# EAGLE design PanningMixer (EAGLE 7.5.0)
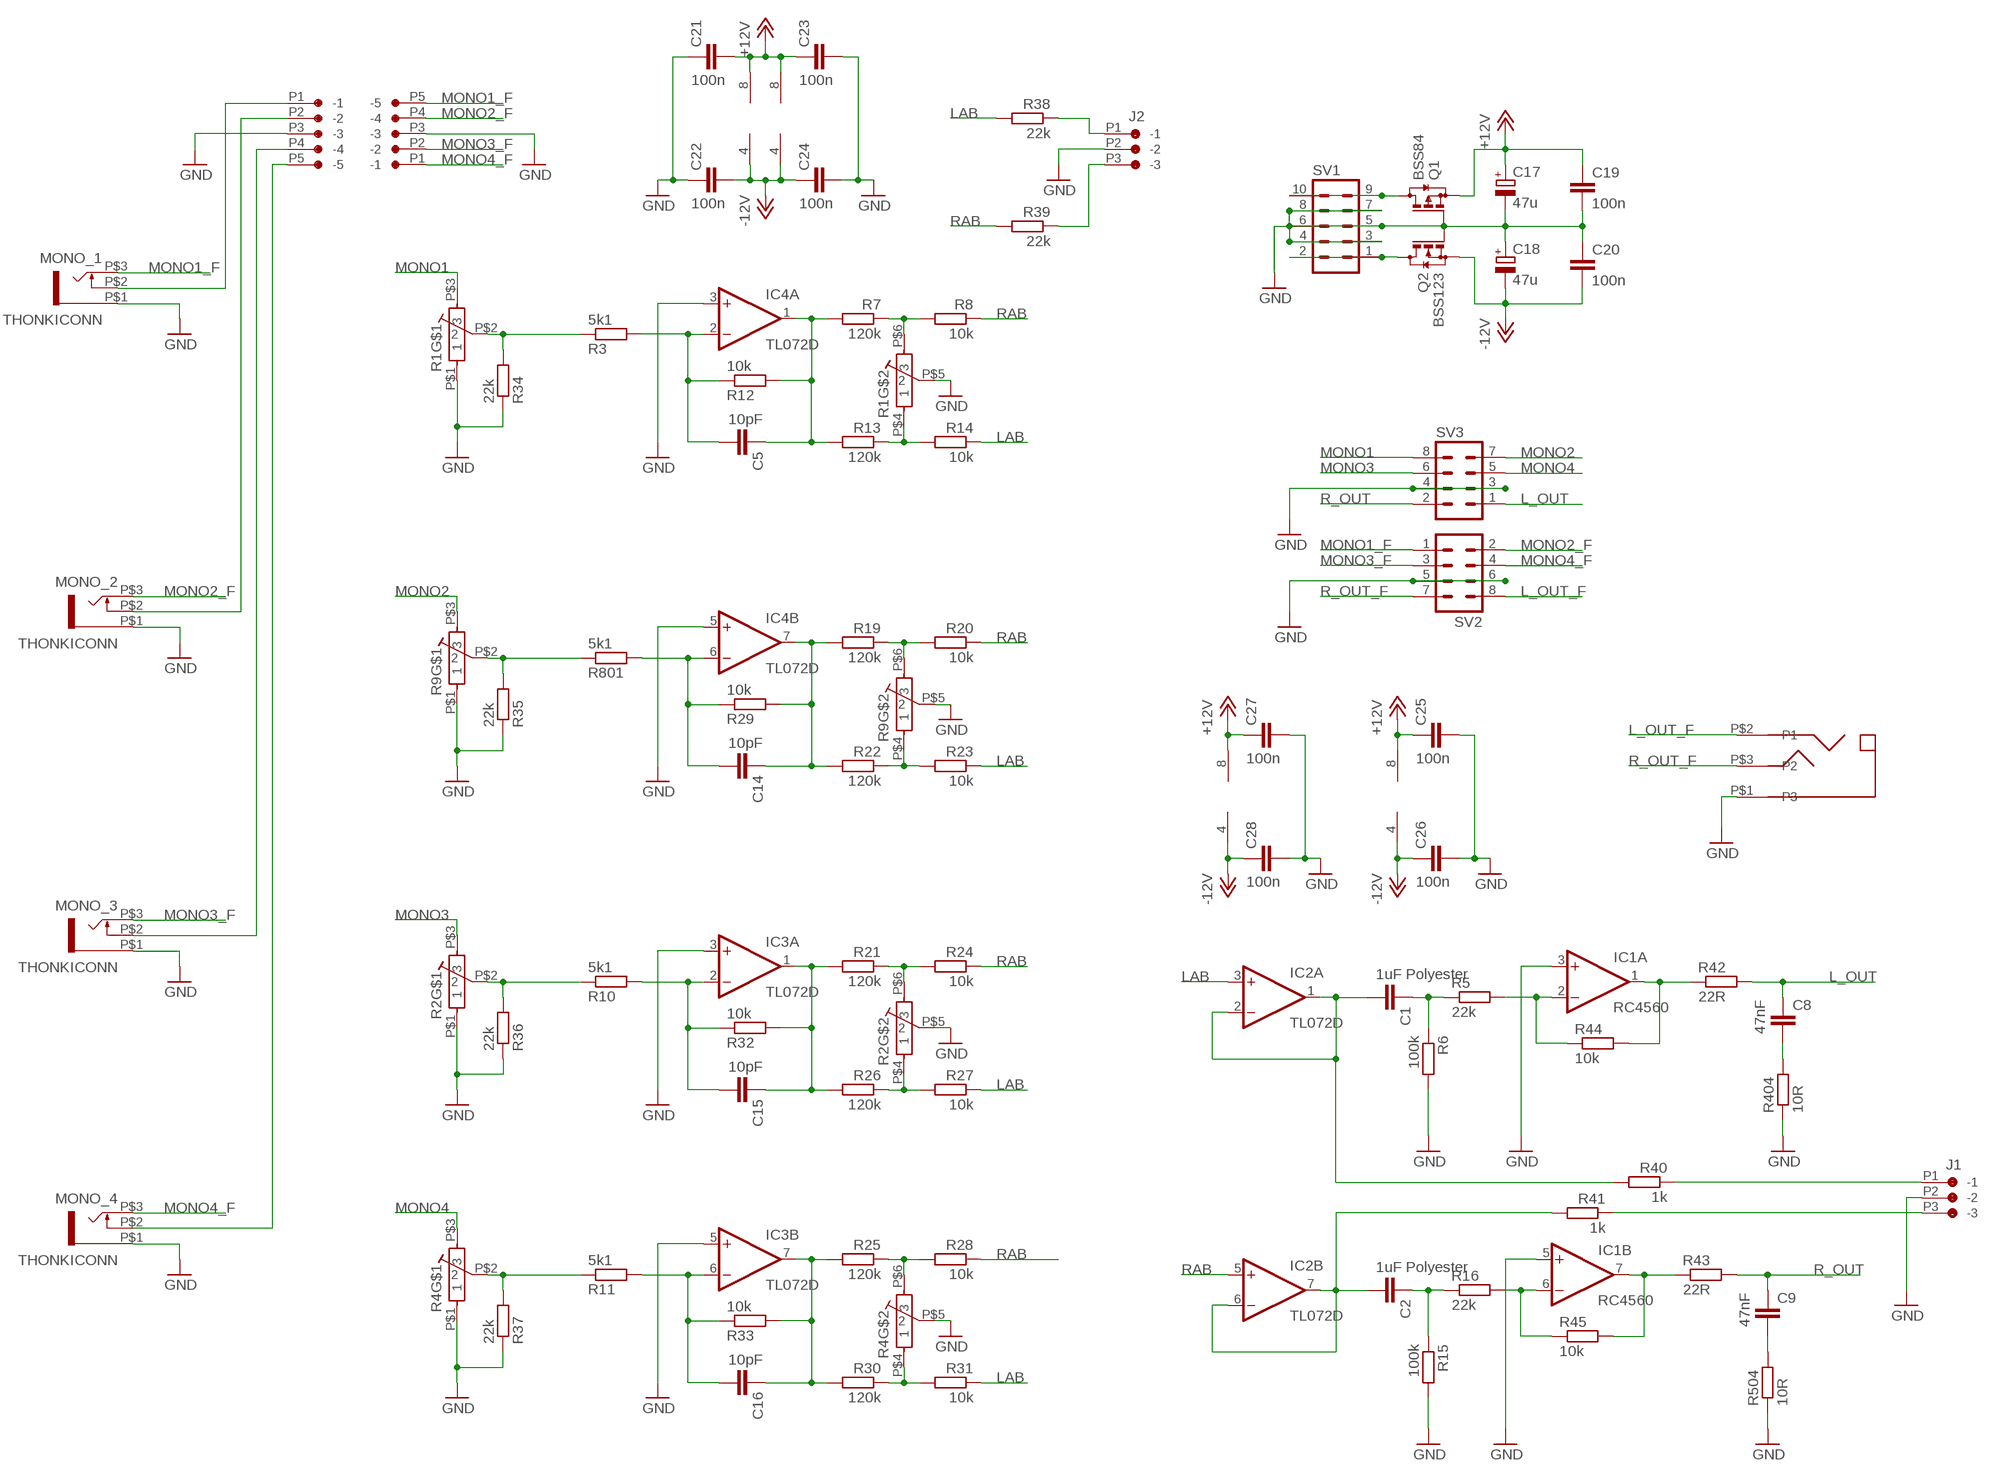
[diagram p0: schematic, sheet 1]

## Parts
C1  1uF Polyester  C-EUC1210  [C1210]
C2  1uF Polyester  C-EUC1210  [C1210]
C5  10pF  C-EUC0603  [C0603]
C8  47nF  C-EUC0603  [C0603]
C9  47nF  C-EUC0603  [C0603]
C14  10pF  C-EUC0603  [C0603]
C15  10pF  C-EUC0603  [C0603]
C16  10pF  C-EUC0603  [C0603]
C17  47u  CPOL-EUB  [PANASONIC_B]
C18  47u  CPOL-EUB  [PANASONIC_B]
C19  100n  C-EUC0603  [C0603]
C20  100n  C-EUC0603  [C0603]
C21  100n  C-EUC0603  [C0603]
C22  100n  C-EUC0603  [C0603]
C23  100n  C-EUC0603  [C0603]
C24  100n  C-EUC0603  [C0603]
C25  100n  C-EUC0603  [C0603]
C26  100n  C-EUC0603  [C0603]
C27  100n  C-EUC0603  [C0603]
C28  100n  C-EUC0603  [C0603]
IC1  RC4560  RC4559D  [SO08]
IC2  TL072D  [SO08]
IC3  TL072D  [SO08]
IC4  TL072D  [SO08]
J1  CON-JST_PH_3W  [CON-JST_PH_3W]
J2  CON-JST_PH_3W  [CON-JST_PH_3W]
MONO_1  THONKICONN  [THONKICONN]
MONO_2  THONKICONN  [THONKICONN]
MONO_3  THONKICONN  [THONKICONN]
MONO_4  THONKICONN  [THONKICONN]
Q1  BSS84  [SOT23]
Q2  BSS123  [SOT23]
R1  POT-ALPHA_DUAL_9MM  [POT-ALPA_DUAL_9MM]
R2  POT-ALPHA_DUAL_9MM  [POT-ALPA_DUAL_9MM]
R3  5k1  R-EU_0603  [0603]
R4  POT-ALPHA_DUAL_9MM  [POT-ALPA_DUAL_9MM]
R5  22k  R-EU_0603  [0603]
R6  100k  R-EU_0603  [0603]
R7  120k  R-EU_0603  [0603]
R8  10k  R-EU_0603  [0603]
R9  POT-ALPHA_DUAL_9MM  [POT-ALPA_DUAL_9MM]
R10  5k1  R-EU_0603  [0603]
R11  5k1  R-EU_0603  [0603]
R12  10k  R-EU_0603  [0603]
R13  120k  R-EU_0603  [0603]
R14  10k  R-EU_0603  [0603]
R15  100k  R-EU_0603  [0603]
R16  22k  R-EU_0603  [0603]
R19  120k  R-EU_0603  [0603]
R20  10k  R-EU_0603  [0603]
R21  120k  R-EU_0603  [0603]
R22  120k  R-EU_0603  [0603]
R23  10k  R-EU_0603  [0603]
R24  10k  R-EU_0603  [0603]
R25  120k  R-EU_0603  [0603]
R26  120k  R-EU_0603  [0603]
R27  10k  R-EU_0603  [0603]
R28  10k  R-EU_0603  [0603]
R29  10k  R-EU_0603  [0603]
R30  120k  R-EU_0603  [0603]
R31  10k  R-EU_0603  [0603]
R32  10k  R-EU_0603  [0603]
R33  10k  R-EU_0603  [0603]
R34  22k  R-EU_0603  [0603]
R35  22k  R-EU_0603  [0603]
R36  22k  R-EU_0603  [0603]
R37  22k  R-EU_0603  [0603]
R38  22k  R-EU_0603  [0603]
R39  22k  R-EU_0603  [0603]
R40  1k  R-EU_0603  [0603]
R41  1k  R-EU_0603  [0603]
R42  22R  R-EU_0603  [0603]
R43  22R  R-EU_0603  [0603]
R44  10k  R-EU_0603  [0603]
R45  10k  R-EU_0603  [0603]
R404  10R  R-EU_0603  [0603]
R504  10R  R-EU_0603  [0603]
R801  5k1  R-EU_0603  [0603]
SV1  MA05-2  [MA05-2]
SV2  MA04-2  [MA04-2]
SV3  MA04-2  [MA04-2]
U1  CON-PROSIGNAL_MJ-355W  [CON-PROSIGNAL_MJ-355W]
U2  CON-JST_PH_5W  [CON-JST_PH_5W]
U4  CON-JST_PH_5W  [CON-JST_PH_5W]

## Nets
+12V: C17.+ C19.1 C21.2 C23.1 C25.1 C27.1 IC1.8(P:V+) IC2.8(P:V+) IC3.8(P:V+) IC4.8(P:V+) Q1.2(S)
-12V: C18.- C20.2 C22.2 C24.1 C26.1 C28.1 IC1.4(P:V-) IC2.4(P:V-) IC3.4(P:V-) IC4.4(P:V-) Q2.2(S)
GND: C17.- C18.+ C19.2 C20.1 C21.1 C22.1 C23.2 C24.2 C25.2 C26.2 C27.2 C28.2 IC1.3(A:+IN) IC1.5(B:+IN) IC3.3(A:+IN) IC3.5(B:+IN) IC4.3(A:+IN) IC4.5(B:+IN) J1.P2(-2) J2.P2(-2) Q1.1(G) Q2.1(G) R1.P$1 R1.P$5 R2.P$1 R2.P$5 R4.P$1 R4.P$5 R6.2 R9.P$1 R9.P$5 R15.2 R34.1 R35.1 R36.1 R37.1 R404.1 R504.1 SV1.3 SV1.4 SV1.5 SV1.6 SV1.7 SV1.8 SV3.3 SV3.4
GND_A: MONO_1.P$1 MONO_2.P$1 MONO_3.P$1 MONO_4.P$1 SV2.5 SV2.6 U1.P$1(P3) U2.P3(-3) U4.P3(-3) ; supply symbol labelled GND
L_OUT: C8.1 R42.2 SV3.1
L_OUT_F: SV2.8 U1.P$2(P1)
LAB: IC2.3(A:+IN) R14.1 R23.1 R27.1 R31.1 R38.2
MONO1: R1.P$3 SV3.8
MONO1_F: MONO_1.P$3 SV2.1 U4.P5(-5)
MONO2: R9.P$3 SV3.7
MONO2_F: MONO_2.P$3 SV2.2 U4.P4(-4)
MONO3: R2.P$3 SV3.6
MONO3_F: MONO_3.P$3 SV2.3 U4.P2(-2)
MONO4: R4.P$3 SV3.5
MONO4_F: MONO_4.P$3 SV2.4 U4.P1(-1)
N$1: R4.P$2 R11.1 R37.2
N$2: MONO_2.P$2 U2.P2(-2)
N$4: MONO_1.P$2 U2.P1(-1)
N$5: C1.1 R5.1 R6.1
N$6: MONO_3.P$2 U2.P4(-4)
N$7: IC1.2(A:-IN) R5.2 R44.1
N$8: R1.P$2 R3.1 R34.2
N$9: C5.2 IC4.2(A:-IN) R3.2 R12.1
N$10: R2.P$2 R10.1 R36.2
N$11: R9.P$2 R35.2 R801.1
N$12: C9.2 R504.2
N$14: J2.P1(-1) R38.1
N$15: MONO_4.P$2 U2.P5(-5)
N$16: J1.P1(-1) R40.1
N$17: R1.P$4 R13.1 R14.2
N$19: R1.P$6 R7.1 R8.2
N$20: J1.P3(-3) R41.1
N$21: C8.2 R404.2
N$22: C2.1 R15.1 R16.1
N$23: C5.1 IC4.1(A:OUT) R7.2 R12.2 R13.2
N$24: J2.P3(-3) R39.1
N$25: C16.1 IC3.7(B:OUT) R25.2 R30.2 R33.2
N$26: C14.1 IC4.7(B:OUT) R19.2 R22.2 R29.2
N$27: IC1.1(A:OUT) R42.1 R44.2
N$28: IC1.6(B:-IN) R16.2 R45.1
N$30: C1.2 IC2.1(A:OUT) IC2.2(A:-IN) R40.2
N$31: IC1.7(B:OUT) R43.1 R45.2
N$32: C2.2 IC2.6(B:-IN) IC2.7(B:OUT) R41.2
N$33: R9.P$6 R19.1 R20.2
N$35: R9.P$4 R22.1 R23.2
N$36: R2.P$6 R21.1 R24.2
N$37: C15.1 IC3.1(A:OUT) R21.2 R26.2 R32.2
N$38: R2.P$4 R26.1 R27.2
N$39: R4.P$6 R25.1 R28.2
N$41: R4.P$4 R30.1 R31.2
N$43: C14.2 IC4.6(B:-IN) R29.1 R801.2
N$44: Q2.3(D) SV1.1 SV1.2
N$45: C15.2 IC3.2(A:-IN) R10.2 R32.1
N$46: Q1.3(D) SV1.9 SV1.10
N$47: C16.2 IC3.6(B:-IN) R11.2 R33.1
R_OUT: C9.1 R43.2 SV3.2
R_OUT_F: SV2.7 U1.P$3(P2)
RAB: IC2.5(B:+IN) R8.1 R20.1 R24.1 R28.1 R39.2

## Library data of the parts
C1 C2 C5 C8 C9 C14-C16 C19-C28 = Rebel:C-EU: CAPACITOR, European symbol
C17 C18 = Rebel:CPOL-EU: POLARIZED CAPACITOR, European symbol
IC1 = linear:RC4559: OP AMP
IC2-IC4 = linear:TL072: OP AMP
J1 J2 = Rebel:CON-JST_PH_3W
MONO_1-MONO_4 = Rebel:THONKICONN
Q1 = transistor-small-signal:BSS84: P-CHANNEL MOS FET
Q2 = transistor-small-signal:BSS123: N-CHANNEL MOS FET
R1 R2 R4 R9 = Rebel:POT-ALPHA_DUAL_9MM
R3 R5-R8 R10-R16 R19-R45 R404 R504 R801 = Rebel:R-EU_: RESISTOR, European symbol
SV1 = con-lstb:MA05-2: PIN HEADER; OC_FARNELL: unknown; OC_NEWARK: unknown
SV2 SV3 = con-lstb:MA04-2: PIN HEADER; OC_FARNELL: unknown; OC_NEWARK: unknown
U1 = Rebel:CON-PROSIGNAL_MJ-355W
U2 U4 = Rebel:CON-JST_PH_5W

## Board
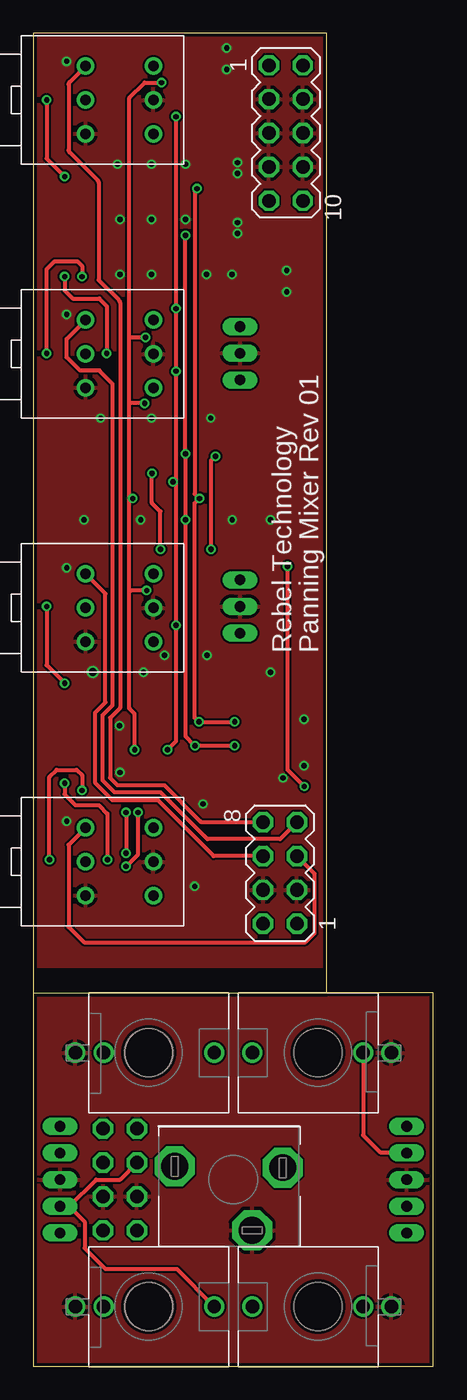
[diagram p1: board, top side]
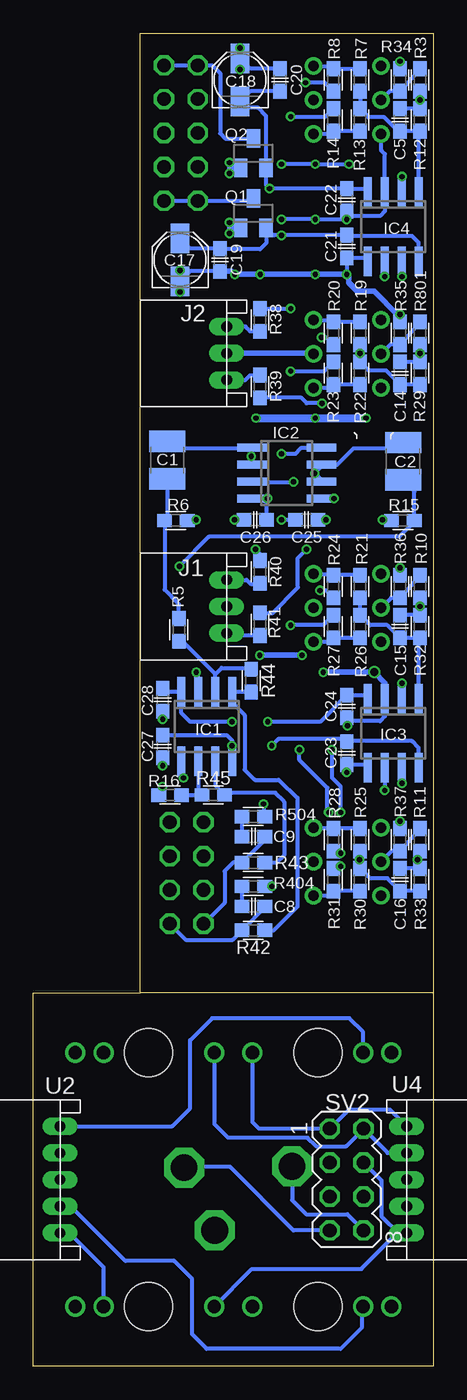
[diagram p2: board, bottom side, seen from below]

Size 30 x 100 mm. Coordinates in mm from the lower left corner, seen from the top.
Outline: 22,28 30,28 30,0 0,0 0,28
Outline: 0,28 22,28
Outline: 0,28 0,100 22,100 22,28
Copper layers (1*16): Top 0.035mm / dielectric 1.5mm / Bottom 0.035mm
Design rules "SeeedStudio_2layer_DRU_no_angle_20140221": minimum track width 6mil, minimum drill 12mil, track to track 6mil, track to pad 6mil, pad to pad 6mil, via to via 6mil, smd to smd 0mil, copper to edge 10mil, drill to drill 10mil, minimum pad ring 10mil, minimum via ring 6mil, stop-mask expansion 2mil, vias tented up to drill 100mil, thermal gap 10mil

### Footprints (pad centres in the part's own frame; a part is rotated, then mirrored left to right if it is on the bottom)
C1210 = smd 1.6 x 2.7: 1 -1.4,0; 2 1.4,0
C0603 = smd 1.1 x 1: 1 -0.85,0; 2 0.85,0
PANASONIC_B = smd 2.2 x 1.4: + 1.6,0; - -1.6,0
SO08 = smd 0.6 x 2.2: 1 -1.905,-2.6; 2 -0.635,-2.6; 3 0.635,-2.6; 4 1.905,-2.6; 5 1.905,2.6; 6 0.635,2.6; 7 -0.635,2.6; 8 -1.905,2.6
CON-JST_PH_3W = drill 0.8 long: P1 0,0; P2 -2,0; P3 -4,0
THONKICONN = drill 1: P$1 0,-5.5; P$2 0,-3.38; P$3 0,4.92 | hole 3.6: 0,0
SOT23 = smd 1 x 1.4: 1 -0.95,-1.1; 2 0.95,-1.1; 3 0,1.1
POT-ALPA_DUAL_9MM = drill 0.8: P$1 -2.54,5.08; P$2 0,5.08; P$3 2.54,5.08; P$4 -2.54,0; P$5 0,0; P$6 2.54,0
0603 = smd 1.1 x 1: 1 -0.85,0; 2 0.85,0
MA05-2 = drill 1.016 octagon: 1 -5.08,-1.27; 2 -5.08,1.27; 3 -2.54,-1.27; 4 -2.54,1.27; 5 0,-1.27; 6 0,1.27; 7 2.54,-1.27; 8 2.54,1.27; 9 5.08,-1.27; 10 5.08,1.27
MA04-2 = drill 1.016 octagon: 1 -3.81,-1.27; 2 -3.81,1.27; 3 -1.27,-1.27; 4 -1.27,1.27; 5 1.27,-1.27; 6 1.27,1.27; 7 3.81,-1.27; 8 3.81,1.27
CON-PROSIGNAL_MJ-355W = drill 2 octagon: P$1 -3.8,-1.4; P$2 1,4.4; P$3 0.9,-3.7
CON-JST_PH_5W = drill 0.8 long: P1 0,0; P2 -2,0; P3 -4,0; P4 -6,0; P5 -8,0

### Placement (x,y rotation side)
C1  19.95,67.98 90 bottom
C2  2.27,67.89 90 bottom
C5  2.5,93.5 90 bottom
C8  13.5,34.5 180 bottom
C9  13.5,39.73 180 bottom
C14  2.5,74.5 90 bottom
C15  2.5,55.5 90 bottom
C16  2.5,36.5 90 bottom
C17  19,83 90 bottom
C18  14.5,96.5 90 bottom
C19  16,83 270 bottom
C20  11.5,96.5 270 bottom
C21  6.5,84 90 bottom
C22  6.5,87.5 90 bottom
C23  6.5,46 270 bottom
C24  6.5,49.5 270 bottom
C25  9.5,63.5 0 bottom
C26  13.35,63.5 180 bottom
C27  20.3,46.5 270 bottom
C28  20.3,50 270 bottom
IC1  17,48 180 bottom
IC2  11,67 270 bottom
IC3  3,47.5 180 bottom
IC4  3,85.5 180 bottom
J1  15.5,59 90 bottom
J2  15.5,78 90 bottom
MONO_1  8.65,23.52 270 top
MONO_2  21.35,23.52 90 top
MONO_3  8.65,4.47 270 top
MONO_4  21.35,4.47 90 top
Q1  13.5,86.5 0 bottom
Q2  13.5,91 0 bottom
R1  9,95 90 top
R2  9,56.9 90 top
R3  1,96.5 270 bottom
R4  9,37.85 90 top
R5  19.08,55.24 270 bottom
R6  19.31,63.45 0 bottom
R7  5.5,96.5 270 bottom
R8  7.5,96.5 90 bottom
R9  9,75.95 90 top
R10  1,58.5 270 bottom
R11  1,39.5 270 bottom
R12  22k  [0603]  1,93.5 270 bottom
R13  5.5,93.5 90 bottom
R14  7.5,93.5 270 bottom
R15  2.28,63.45 180 bottom
R16  19.74,42.85 0 bottom
R19  5.5,77.5 270 bottom
R20  7.5,77.5 90 bottom
R21  5.5,58.5 270 bottom
R22  5.5,74.5 90 bottom
R23  7.5,74.5 270 bottom
R24  7.5,58.5 90 bottom
R25  5.5,39.5 270 bottom
R26  5.5,55.5 90 bottom
R27  7.5,55.5 270 bottom
R28  7.5,39.5 90 bottom
R29  22k  [0603]  1,74.5 270 bottom
R30  5.5,36.5 90 bottom
R31  7.5,36.5 270 bottom
R32  22k  [0603]  1,55.5 270 bottom
R33  22k  [0603]  1,36.5 270 bottom
R34  2.5,96.5 270 bottom
R35  2.5,77.5 270 bottom
R36  2.5,58.5 270 bottom
R37  2.5,39.5 270 bottom
R38  13,78.5 90 bottom
R39  13,73.5 270 bottom
R40  13,59.6 90 bottom
R41  13,55.67 90 bottom
R42  13.5,32.7 180 bottom
R43  13.5,37.78 180 bottom
R44  13.65,51.44 270 bottom
R45  16.51,42.86 0 bottom
R404  13.5,36 180 bottom
R504  13.5,41.23 180 bottom
R801  1,77.5 270 bottom
SV1  18.94,92.52 270 top
SV2  6.5,14 270 bottom
SV3  18.5,37 90 top
U1  15,14 90 top
U2  28,18 90 bottom
U4  2,10 270 bottom

### Tracks (layer width: path | path; a pad name or v marks a point on that pad's centre or on a via)
+12V  (via drill 0.4)
  Top 0.305: v11.4,84.85 v11.4,68.45 v11.4,63.5 11.4,47.27 v12.12,46.55 v15.1,46.55
  Bottom 0.305: IC4.8 1.09,84.3 1.6,84.8 6.45,84.8 C21.2 v11.4,84.85 12,84.85 Q1.2 12.55,84.25 13,83.8 15.95,83.8 C19.1 18.25,83.85 C17.+ | IC3.8 1.09,46.4 1.6,46.9 6.45,46.9 C23.1 6.7,47.05 11.62,47.05 v12.12,46.55 | IC2.8 9.9,68.9 10.35,68.45 v11.4,68.45 | C27.1 15.5,47.35 15.1,46.95 v15.1,46.55 IC1.8 | C25.1 v11.4,63.5
-12V  (via drill 0.4)
  Top 0.305: v15.1,48.35 v12.42,48.35 12.1,48.67 12.1,64.75 v12.45,65.1 12.1,65.45 12.1,88.17 v12.29,88.35
  Bottom 0.305: IC4.4 5.16,88.35 C22.2 v12.29,88.35 | IC3.4 5.16,50.35 C24.1 8.5,48.35 v12.42,48.35 | C18.- 13.75,95.65 C20.2 | 14,94.4 13.15,94.4 12.55,93.8 Q2.2 12.55,88.61 v12.29,88.35 | v15.1,48.35 18.25,48.35 18.9,49 IC1.4 20.05,50.6 C28.1 | IC2.4 v12.46,65.09 v12.45,65.1 12.5,65.05 C26.1 | v12.29,88.35 12.1,88.35
  Bottom 0.406: 14,94.4 C18.-
GND  (via drill 0.4, 0.6)
  Bottom 0.305: R1.P$1 3.9,92.44 3.9,91.2 3.63,90.94 IC4.3 3.63,86.67 4,86.3 6.15,86.3 C22.1 6.35,86.5 6.35,86.36 6.66,86.05 v8.86,86.05 v11.4,86.05 | IC4.5 5.16,83.15 C21.1 v6.5,81.92 | IC3.3 3.63,48.77 4,48.4 6.25,48.4 C24.2 | IC3.5 5.16,45.15 C23.2 v6.5,44.55 | C20.1 13.75,97.35 | 13.75,97.35 C18.+ v14.5,98.9 | C19.2 18.25,82.15 | 18.25,82.15 C17.- | 14.53,89.98 Q2.1 14.85,89.5 v15.3,89.5 v15.3,90.3 15.05,90.3 15.05,89.55 | 13.75,97.35 14.45,97.35 14.5,97.4 | 18.25,82.15 18.95,82.15 v19,82.2 | Q1.1 14.85,85.8 v15.3,85.8 v15.3,85 15.05,85 | 15.05,85 14.5,85 | v2.5,40.9 R37.1 | v2.5,59.9 R36.1 | v2.5,97.9 R34.1 | 15.05,85 15.05,85.75 | R504.1 v12.73,42.18 | R404.1 v12.1,36 | C25.2 v8.05,63.5 | 20.3,48.95 C28.2 | 6.35,90.17 8.89,90.17 8.9,90.18 v11.4,90.18 | R35.1 v2.5,78.9 | R15.2 3.76,63.45 v3.81,63.5 | R6.2 17.83,63.45 v17.78,63.5 | C26.2 v14.92,63.5 | IC1.3 17.64,51.92 v17.78,52.07 | IC1.5 18.91,44.3 v18.73,44.13
  Bottom 0.406: C27.2 v20.3,45.05 | C28.2 v20.3,48.55 | v2.5,78.9 2.7,78.9 4.45,80.64 5.71,80.64 6.35,81.28 6.35,81.77 v6.5,81.92 14.92,81.92 15.16,82.15 C19.2 | J2.P2 9.05,76 R9.P$5 | v8.26,52.07 v4.45,52.07 3.63,51.26 IC3.3 | v9.84,53.34 v13.02,53.34
  Bottom 0.61: 13.34,71.12 v8.87,71.12 v8.86,71.13 v5.05,71.13 | R35.1 2.5,78.7 2.54,78.74
  other vias: 14.5,97.3 19,80.6 6.45,48.05 6.5,86.05 8.86,90.18 6.32,90.18 8.86,81.92 12.99,81.92 13.3,71.13 14.89,81.92
  pour Top: 22,30 0,30 0,100 22,100
GND_A
  pour Top: 0,28 30,28 30,0 0,0
L_OUT
  Bottom 0.305: SV3.1 18.58,32 15.05,32 R42.2 12.65,34.4 C8.1
L_OUT_F
  Bottom 0.305: U1.P$2 10.6,12.45 9.55,11.4 6.44,11.4 SV2.8
LAB  (via drill 0.4)
  Top 0.305: v6.95,37.5 7.85,38.4 v7.85,41.55 | 10.7,66.25 v10.7,55.6 10.7,46.9 v10.05,46.25 | 10.7,66.25 v10.7,74.65 v10.7,79.35 v10.7,93.75 | v10.48,66.35 10.7,66.25
  Bottom 0.305: R31.1 7.1,37.35 v6.95,37.5 | v10.7,93.75 8.1,93.75 R14.1 | v10.7,74.65 8.2,74.65 R23.1 | v7.85,41.55 7.9,41.55 7.95,41.6 7.95,43.4 10.05,45.5 v10.05,46.25 | R27.1 8.25,55.6 v10.7,55.6 | IC2.3 12.46,66.36 12.45,66.35 v10.48,66.35 | R38.2 v10.7,79.35
MONO1
  Top 0.305: SV3.8 17.17,40.81 arc45 17.15,40.8 12.71,40.8 arc-45 12.53,40.87 9.8,43.6 6.3,43.6 5.75,44.15 5.75,48.65 6.5,49.4 6.5,79.8 arc45 6.43,79.97 4.9,81.5 4.9,88.8 arc45 4.83,88.97 2.72,91.08 arc-45 2.65,91.25 2.65,96.17 arc-45 2.72,96.34 R1.P$3
MONO1_F
  Bottom 0.305: U4.P5 3.25,19.25 6.33,19.25 SV2.1 13.06,17.81 13.55,18.3 13.55,23.5 MONO_1.P$3
MONO2
  Top 0.305: R9.P$3 2.5,77.07 2.5,75.7 3.5,74.7 4.95,74.7 5.95,73.7 5.95,49.6 5.2,48.85 5.2,43.95 6.1,43.05 9.55,43.05 13.05,39.55 18.51,39.55 SV3.7
MONO2_F
  Bottom 0.305: MONO_2.P$3 16.4,23.5 16.4,18.15 15.4,17.15 9.45,17.15 8.8,16.5 6.54,16.5 SV2.2 3.42,16 U4.P4
MONO3
  Top 0.305: SV3.6 13.53,38.27 9.35,42.45 5.95,42.45 4.65,43.75 4.65,49.05 5.4,49.8 5.4,57.96 R2.P$3
MONO3_F
  Top 0.305: SV2.3 6.5,14 4.7,14 2.7,12 | U4.P2 2.7,12 | 2.7,12 3.85,10.85 3.85,8.85 5.4,7.3 10.74,7.3 MONO_3.P$3
MONO4
  Top 0.305: R4.P$3 2.65,39.12 2.65,32.95 3.8,31.8 20.4,31.8 21.1,32.5 21.1,36.94 SV3.5
MONO4_F
  Bottom 0.305: SV2.4 3.9,13.94 3.9,11.25 2.65,10 | 2.65,10 U4.P1 | MONO_4.P$3 13.61,7.3 5.4,7.3 2.7,10 2.65,10
N$1
  Bottom 0.305: R4.P$2 3.12,38.65 R37.2 R11.1
N$2
  Top 0.305: MONO_2.P$2 24.73,17.32 26,16.05 27.95,16.05 U2.P2
N$4
  Bottom 0.305: U2.P1 19.6,18 18.25,19.35 18.25,24.45 16.6,26.1 6.3,26.1 5.27,25.07 MONO_1.P$2
N$5
  Bottom 0.305: C1.1 19.95,63.66 R6.1 20.16,58.26 19.08,57.18 R5.1
N$6
  Bottom 0.305: U2.P4 27.2,12 23.1,7.9 19.45,7.9 18.1,6.55 18.1,2.4 17,1.3 6.95,1.3 5.37,2.88 5.37,4.33 MONO_3.P$2
N$7
  Bottom 0.305: IC1.2 16.36,51.9 | 16.36,51.9 15.88,52.39 13.76,52.39 R44.1 | 16.36,51.9 16.36,51.92 18.84,54.4 R5.2
N$8
  Bottom 0.305: R1.P$2 3.27,95.65 R34.2 R3.1
N$9  (via drill 0.4)
  Top 0.305: v1,95 1,90.6 v2.35,89.25
  Bottom 0.305: R3.2 v1,95 R12.1 C5.2 | IC4.2 2.37,89.23 v2.35,89.25
N$10
  Bottom 0.305: R2.P$2 3.17,57.65 R36.2 R10.1
N$11
  Bottom 0.305: R9.P$2 3.22,76.65 R35.2 R801.1
N$12
  Bottom 0.305: C9.2 R504.2
N$14
  Bottom 0.305: J2.P1 14.1,78 13.75,77.65 R38.1
N$15
  Bottom 0.305: MONO_4.P$2 24.73,7.43 27.25,9.95 27.95,9.95 U2.P5
N$16
  Bottom 0.305: J1.P1 14,59 13.7,58.7 13.05,58.7 R40.1
N$17
  Bottom 0.305: R13.1 R14.2 7.69,92.46 R1.P$4
N$19
  Bottom 0.305: R1.P$6 7.5,97.54 R8.2 R7.1
N$20
  Bottom 0.305: R41.1 15.32,54.82 J1.P3
N$21
  Bottom 0.305: C8.2 R404.2
N$22  (via drill 0.4)
  Top 0.305: v19.05,60.01 19.05,44.77 v20.32,43.5
  Bottom 0.305: v19.05,60.01 16.83,62.23 2.54,62.23 1.43,63.34 R15.1 1.43,65.65 C2.1 | R16.1 20.59,43.23 v20.32,43.5
N$23
  Bottom 0.305: R7.2 R13.2 4.85,93.7 3.7,93.7 2.65,92.65 C5.1 R12.2 1.09,92.56 IC4.1
N$24
  Bottom 0.305: J2.P3 14.1,74 13.75,74.35 R39.1
N$25  (via drill 0.4)
  Top 0.305: v5.55,38 5.55,41.45 4.9,42.1 3.15,42.1 2.35,42.9 v2.35,43.75 2.35,43.8
  Bottom 0.305: R33.2 C16.1 3.45,36.6 4.75,36.6 R30.2 v5.55,38 R25.2 | IC3.7 2.37,43.77 v2.35,43.75
N$26  (via drill 0.4)
  Top 0.305: v2.35,81.75 2.35,80.7 2.95,80.1 4.95,80.1 5.5,79.55 v5.5,76
  Bottom 0.305: R29.2 C14.1 3.55,74.7 4.85,74.7 R22.2 v5.5,76 R19.2 | IC4.7 2.37,81.77 v2.35,81.75
N$27
  Bottom 0.305: R42.1 11.96,32.7 10.2,34.47 10.2,42.63 11.6,43.98 13.38,43.98 14.15,44.75 14.15,48.85 15.1,49.8 IC1.1 15.08,50.59 R44.2
N$28
  Bottom 0.305: 17.62,45.38 IC1.6 17.64,43.14 R45.1 17.37,42.85 R16.2
N$30  (via drill 0.4)
  Top 0.305: v13.34,61.28 13.34,67.94 v13.65,68.26
  Bottom 0.305: R40.2 13,60.94 v13.34,61.28 | C1.2 19.42,68.85 13.65,68.85 IC2.1 13.65,68.96 v13.65,68.26 13.6,68.21 IC2.2
N$31
  Bottom 0.305: IC1.7 16.35,45.38 16.35,43.55 R45.2 15.51,43.02 11.85,43.02 11.2,42.37 11.2,38.33 11.75,37.78 R43.1
N$32  (via drill 0.4)
  Top 0.305: v9.53,61.28 9.53,64.14 8.89,64.77 v8.89,66.99
  Bottom 0.305: IC2.7 7.21,67.64 6,68.85 2.71,68.85 C2.2 | R41.2 12.06,56.52 10.16,58.42 10.16,60.64 v9.53,61.28 | 8.41,67.63 IC2.7 | IC2.7 8.4,67.48 v8.89,66.99 8.4,66.5 IC2.6
N$33
  Bottom 0.305: R19.1 R20.2 7.5,78.49 R9.P$6
N$35
  Bottom 0.305: R22.1 R23.2 7.74,73.41 R9.P$4
N$36
  Bottom 0.305: R2.P$6 7.5,59.44 R24.2 R21.1
N$37
  Bottom 0.305: R21.2 R26.2 4.75,55.6 3.45,55.6 C15.1 R32.2 1.09,54.55 IC3.1
N$38
  Bottom 0.305: R26.1 R27.2 7.79,54.36 R2.P$4
N$39
  Bottom 0.305: R25.1 R28.2 7.5,40.39 R4.P$6
N$41
  Bottom 0.305: R30.1 R31.2 7.84,35.31 R4.P$4
N$43  (via drill 0.4)
  Top 0.305: v1,76 1,82.3 1.6,82.9 3.3,82.9 3.65,82.55 v3.65,81.75
  Bottom 0.305: R801.2 v1,76 R29.1 C14.2 | IC4.6 3.63,81.77 v3.65,81.75
N$44
  Bottom 0.305: SV1.2 SV1.1 16.6,97.6 16,97 16,92.5 15.6,92.1 Q2.3
N$45  (via drill 0.4)
  Top 0.305: v1,57 1,52.6 v2.35,51.25
  Bottom 0.305: R10.2 v1,57 R32.1 C15.2 | IC3.2 2.37,51.23 v2.35,51.25
N$46
  Bottom 0.305: SV1.10 SV1.9 13.66,87.44 Q1.3
N$47  (via drill 0.4)
  Top 0.305: v1.2,38 1.2,44.2 1.75,44.75 3.25,44.75 3.65,44.35 v3.65,43.2
  Bottom 0.305: C16.2 R33.1 v1.2,38 R11.2 | IC3.6 3.63,43.77 v3.65,43.2
R_OUT
  Bottom 0.305: SV3.2 15.65,34.77 15.65,37.15 15.02,37.78 R43.2 12.65,39.48 C9.1
R_OUT_F
  Bottom 0.305: SV2.7 10.49,10.19 15.25,14.95 18.65,14.95 U1.P$3
RAB  (via drill 0.4)
  Top 0.305: v6.95,41.55 v6.95,38.5 | v7.6,46.25 7.6,48.95 7.2,49.35 7.2,58.1 | 7.2,58.1 7.2,65.1 | 7.2,65.1 7.2,72.25 | 7.2,72.25 7.2,77.2 | 7.2,77.2 7.2,95.15 8.35,96.3 v9.6,96.3 | 7.2,77.2 v8.4,77.2 | 7.2,58.1 7.3,58.2 v8.5,58.2 | v7.45,65.1 7.2,65.1 | v8.35,72.25 7.2,72.25
  Bottom 0.305: v6.95,38.5 7.35,38.5 R28.1 | v8.4,77.2 8.05,77.2 R20.1 | R8.1 8.15,96.3 v9.6,96.3 | v6.95,41.55 6.95,43.5 7.6,44.15 v7.6,46.25 | R24.1 8.05,58.2 v8.5,58.2 | IC2.5 v7.45,65.1 | v8.35,72.25 9.5,72.25 9.9,72.65 R39.2

### Text on the board
tPlace: Rebel Technology | Panning Mixer Rev 01